# EAGLE design sensor2 (EAGLE 7.3.0)
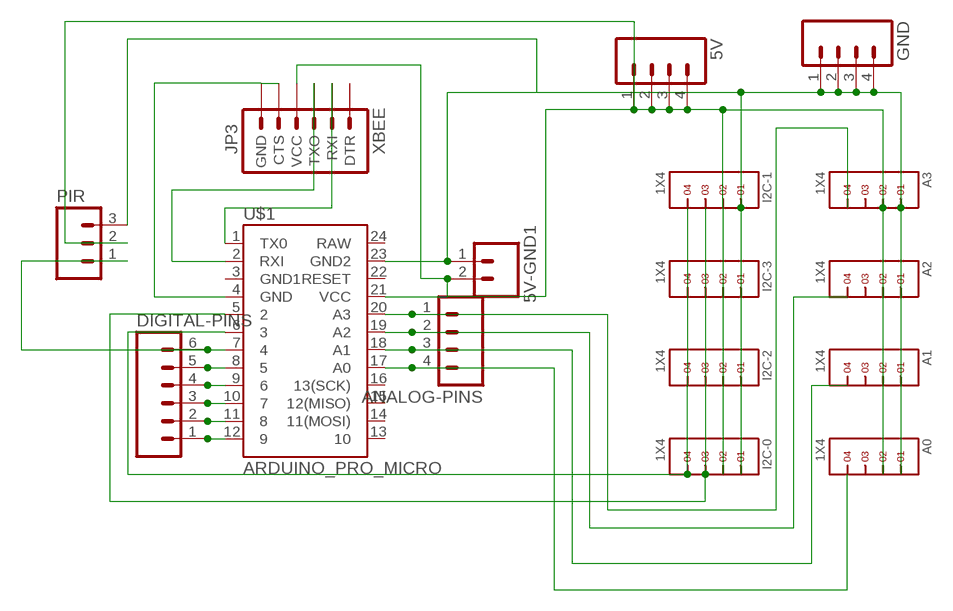
[diagram p0: schematic, sheet 1]

## Parts
5V  M04  [04P]
5V-GND1  M025MM  [SCREWTERMINAL-5MM-2]
A0  1X4  [1X4]
A1  1X4  [1X4]
A2  1X4  [1X4]
A3  1X4  [1X4]
ANALOG-PINS  M04  [04P]
DIGITAL-PINS  M06  [06P]
GND  M04  [04P]
I2C-0  1X4  [1X4]
I2C-1  1X4  [1X4]
I2C-2  1X4  [1X4]
I2C-3  1X4  [1X4]
JP3  XBEE  ARDUINO_SERIAL_PROGRAMPTH  [1X06]
PIR  M03  [03P]
U$1  ARDUINO_PRO_MICRO  [ARDUINO_PRO_MICRO]

## Nets
GND: 5V-GND1.1 A0.1 A1.1 A2.1 A3.1 GND.1 GND.2 GND.3 GND.4 I2C-0.1 I2C-1.1 I2C-2.1 I2C-3.1 PIR.3 U$1.23(GND2)
N$1: I2C-0.4 I2C-1.4 I2C-2.4 I2C-3.4 U$1.6
N$2: A3.4 ANALOG-PINS.1 U$1.20(A3)
N$3: JP3.5(CTS) JP3.6(GND) U$1.4(GND)
N$4: I2C-0.3 I2C-1.3 I2C-2.3 I2C-3.3 U$1.5
N$5: 5V-GND1.2 5V.1 5V.2 5V.3 5V.4 A0.2 A1.2 A2.2 A3.2 I2C-0.2 I2C-1.2 I2C-2.2 I2C-3.2 JP3.4(VCC) PIR.2 U$1.21(VCC)
N$6: A2.4 ANALOG-PINS.2 U$1.19(A2)
N$7: A1.4 ANALOG-PINS.3 U$1.18(A1)
N$8: JP3.2(RXI) U$1.1(TX0)
N$9: A0.4 ANALOG-PINS.4 U$1.17(A0)
N$10: JP3.3(TXO) U$1.2(RXI)
N$11: DIGITAL-PINS.2 U$1.11
N$13: DIGITAL-PINS.3 U$1.10
N$14: DIGITAL-PINS.4 U$1.9
N$15: DIGITAL-PINS.5 U$1.8
N$17: DIGITAL-PINS.6 PIR.1 U$1.7
N$18: DIGITAL-PINS.1 U$1.12
Unconnected: A0.3 A1.3 A2.3 A3.3 JP3.1(DTR) U$1.3(GND1) U$1.13 U$1.14(11(MOSI)) U$1.15(12(MISO)) U$1.16(13(SCK)) U$1.22(RESET) U$1.24(RAW)

## Library data of the parts
5V ANALOG-PINS GND = con-amp-quick:M04: AMP QUICK CONNECTOR; OC_FARNELL: unknown; OC_NEWARK: unknown
5V-GND1 = SparkFun-Connectors:M02: Header 2 Standard 2-pin 0.1" header. Use with straight break away headers (SKU : PRT-00116), right angle break away headers (PRT-00553), swiss pins (PRT-00743), machine pins (PRT-00117), and female headers (PRT-00115). Molex polarized connector foot print use with SKU : PRT-08233 with associated crimp pins and housings.
A0 A1-A3 I2C-0 I2C-1-I2C-3 = headers(2mm):1X4
DIGITAL-PINS = con-amp-quick:M06: AMP QUICK CONNECTOR; OC_FARNELL: unknown; OC_NEWARK: unknown
JP3 = SparkFun-Connectors:ARDUINO_SERIAL_PROGRAM: FTDI connector footprints
PIR = con-amp-quick:M03: AMP QUICK CONNECTOR; OC_FARNELL: unknown; OC_NEWARK: unknown
U$1 = SparkFun-Boards:ARDUINO_PRO_MICRO

## Board
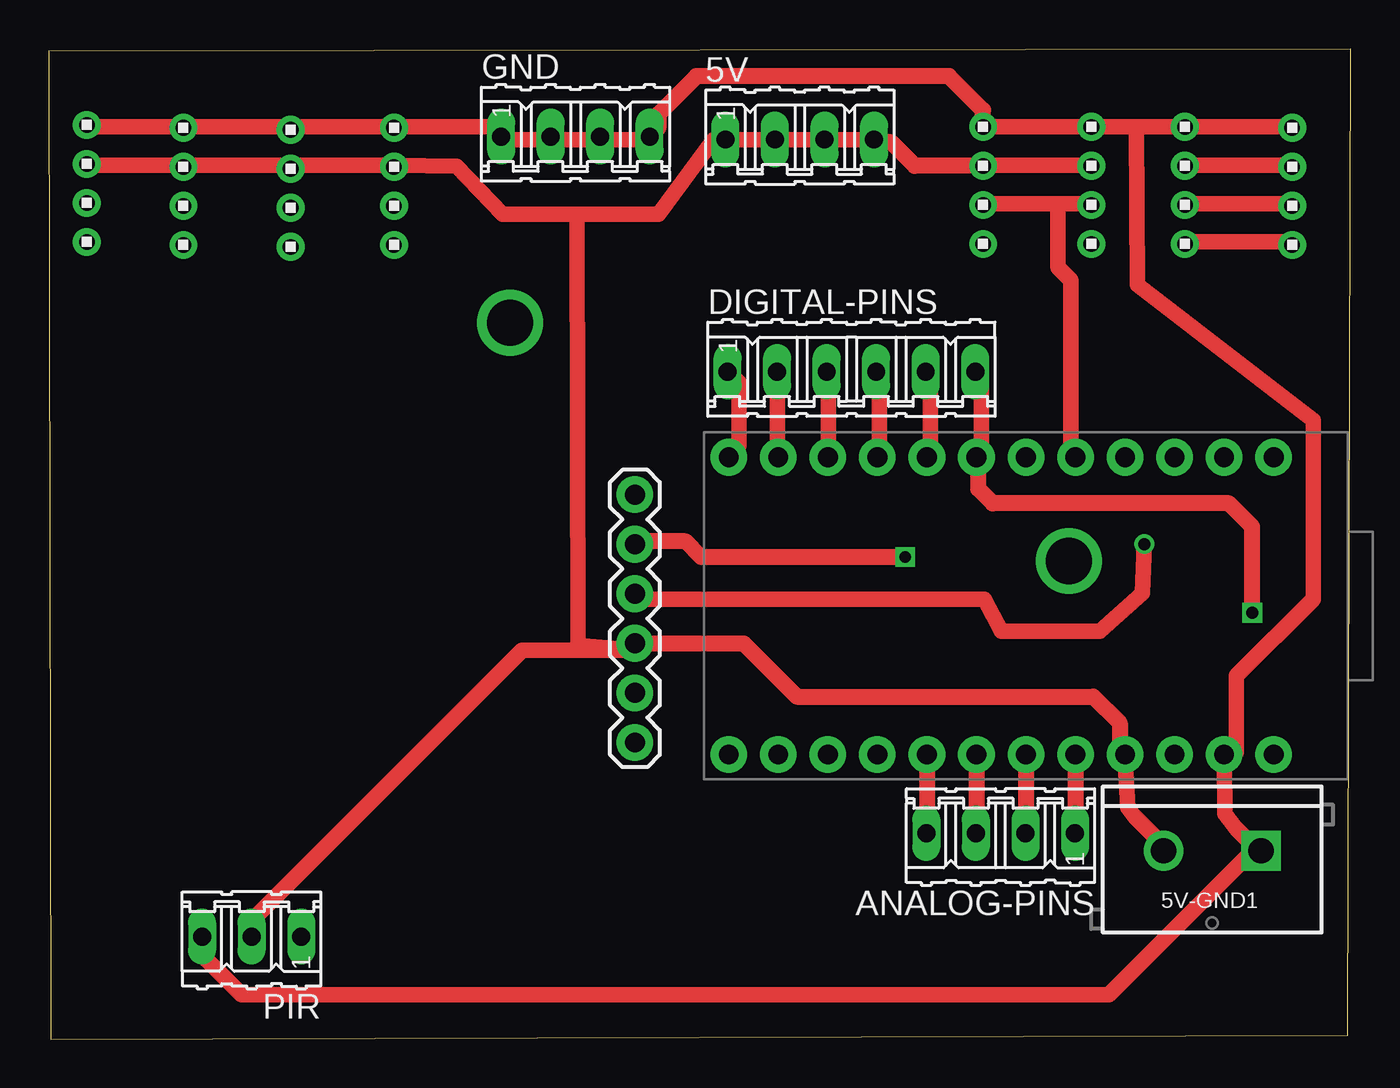
[diagram p1: board, top side]
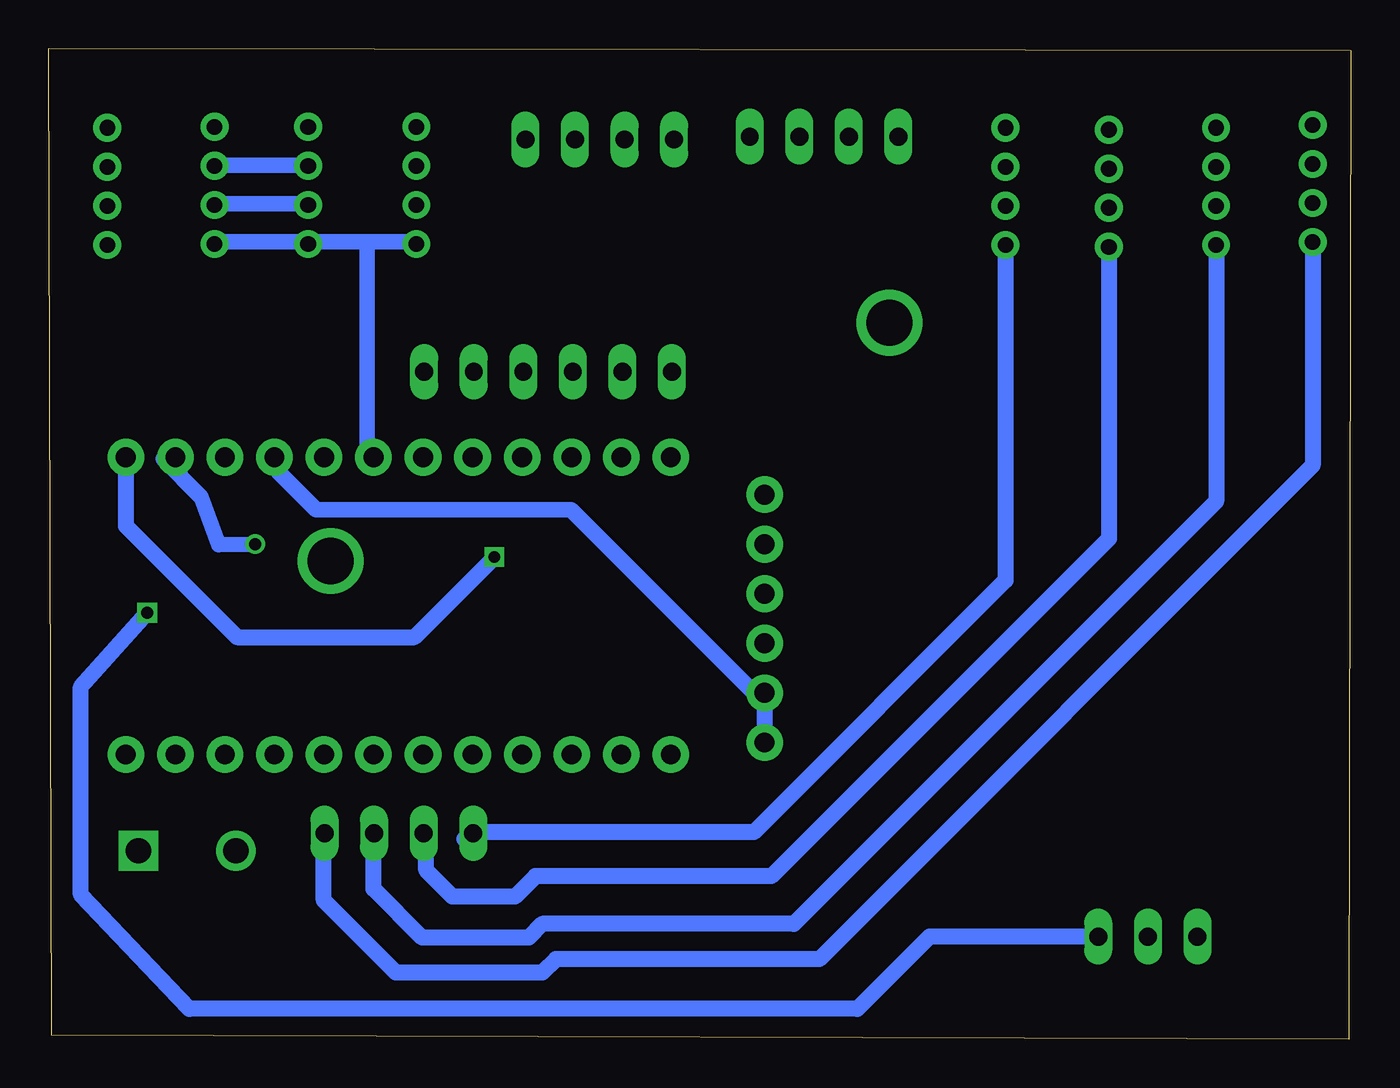
[diagram p2: board, bottom side, seen from below]

Size 66.75 x 50.75 mm. Coordinates in mm from the lower left corner, seen from the top.
Outline: 0.1,0 66.6,0.2 66.75,50.75 0,50.65 0.1,0
Copper layers (1*16): Top 0.035mm / dielectric 1.5mm / Bottom 0.035mm
Design rules "default": minimum track width 0.8mm, minimum drill 24mil, track to track 20mil, track to pad 20mil, pad to pad 20mil, via to via 20mil, smd to smd 8mil, copper to edge 40mil, drill to drill 10mil, minimum pad ring 10mil, minimum via ring 8mil, stop-mask expansion 4mil, vias tented up to drill 0mil, thermal gap 10mil

### Footprints (pad centres in the part's own frame; a part is rotated, then mirrored left to right if it is on the bottom)
04P = drill 0.914 long: 1 -3.81,0; 2 -1.27,0; 3 1.27,0; 4 3.81,0
SCREWTERMINAL-5MM-2 = drill 1.3 pad 2.032 square: 1 0,0 | drill 1.3 pad 2.032: 2 5,0
1X4 = drill 0.8 pad 1.422: 1 -3,0; 2 -1,0; 3 1,0; 4 3,0
06P = drill 0.914 long: 1 -6.35,0; 2 -3.81,0; 3 -1.27,0; 4 1.27,0; 5 3.81,0; 6 6.35,0
1X06 = drill 1.016 pad 1.88: 1 0,0; 2 2.54,0; 3 5.08,0; 4 7.62,0; 5 10.16,0; 6 12.7,0
03P = drill 0.914 long: 1 -2.54,0; 2 0,0; 3 2.54,0
ARDUINO_PRO_MICRO = drill 1.016 pad 1.88: 1 -7.62,12.7; 2 -7.62,10.16; 3 -7.62,7.62; 4 -7.62,5.08; 5 -7.62,2.54; 6 -7.62,0; 7 -7.62,-2.54; 8 -7.62,-5.08; 9 -7.62,-7.62; 10 -7.62,-10.16; 11 -7.62,-12.7; 12 -7.62,-15.24; 13 7.62,-15.24; 14 7.62,-12.7; 15 7.62,-10.16; 16 7.62,-7.62; 17 7.62,-5.08; 18 7.62,-2.54; 19 7.62,0; 20 7.62,2.54; 21 7.62,5.08; 22 7.62,7.62; 23 7.62,10.16; 24 7.62,12.7

### Placement (x,y rotation side)
5V  38.5,46.1 0 top
5V-GND1  62.15,9.65 180 top
A0  17.7,43.7 270 top
A1  12.4,43.6 270 top
A2  6.9,43.7 270 top
A3  1.95,43.85 270 top
ANALOG-PINS  48.8,10.55 180 top
DIGITAL-PINS  41.15,34.2 0 top
GND  27,46.25 0 top
I2C-0  47.9,43.75 270 top
I2C-1  53.45,43.75 270 top
I2C-2  58.25,43.75 270 top
I2C-3  63.75,43.7 270 top
JP3  30.05,27.9 270 top
PIR  10.4,5.25 180 top
U$1  50.1,22.2 270 top

### Tracks (layer width: path | path; a pad name or v marks a point on that pad's centre or on a via)
GND
  Top 0.8: PIR.3 7.92,4.89 7.92,4.23 9.88,2.27 54.35,2.27 61.55,9.47 5V-GND1.1 61.55,10.12 60.89,10.77 60.29,11.54 U$1.23 60.89,14.7 60.89,18.62 64.82,22.55 64.82,31.7 55.82,38.65 55.77,46.74 | I2C-0.1 48.47,46.74 53.05,46.74 I2C-1.1 53.7,46.74 55.77,46.74 | 55.77,46.74 57.62,46.74 I2C-2.1 58.28,46.74 63.51,46.74 I2C-3.1 | GND.4 30.81,46.09 28.85,46.09 GND.3 28.19,46.09 26.23,46.09 GND.2 25.58,46.09 23.62,46.09 GND.1 22.96,46.74 17.73,46.74 A0.1 17.08,46.74 12.5,46.74 A1.1 11.84,46.74 7.27,46.74 A2.1 6.61,46.74 2.03,46.74 A3.1
  Top 0.813: I2C-0.1 47.9,47.6 46.15,49.35 33.2,49.35 31.25,47.4 31.25,46.69 GND.4
N$1
  Top 0.8: I2C-3.4 63.51,40.86 58.28,40.86 I2C-2.4
  Bottom 0.8: 50.43,40.86 53.05,40.86 I2C-1.4 53.7,40.86 57.62,40.86 I2C-2.4 | 50.43,40.86 48.47,40.86 I2C-0.4 | 50.43,40.86 50.43,30.39 U$1.6
N$2
  Top 0.813: U$1.20 52.64,10.58 ANALOG-PINS.1
  Bottom 0.813: A3.4 1.95,29.4 27.25,4.1 40.75,4.1 41.45,3.4 48.95,3.4 52.65,7.1 52.65,10.51 ANALOG-PINS.1
N$3
  Bottom 0.8: U$1.4 55.01,29.74 55.01,29.09 53.05,27.12 39.97,27.12 30.16,17.31 JP3.5
  Bottom 0.813: JP3.5 JP3.6
N$4
  Top 0.8: 51.74,42.82 53.05,42.82 I2C-1.3 | 51.74,42.82 48.47,42.82 I2C-0.3 | I2C-3.3 63.51,42.82 58.28,42.82 I2C-2.3 | 51.74,42.82 51.74,39.55 52.39,38.9 52.39,30.39 U$1.5
  Bottom 0.8: I2C-2.3 57.62,42.82 53.7,42.82 I2C-1.3
N$5
  Top 0.8: U$1.21 55.31,11.84 55.66,11.43 56.97,10.12 5V-GND1.2 | PIR.2 10.54,5.54 10.54,6.2 24.27,19.93 29.5,19.93 JP3.4 29.55,19.98 27.14,20.19 27.09,42.27 | A3.2 2.03,44.78 6.61,44.78 A2.2 7.27,44.78 11.84,44.78 A1.2 12.5,44.78 17.08,44.78 A0.2 17.73,44.78 20.9,44.73 23.26,42.27 27.09,42.27 | 5V.4 41.93,46.09 39.97,46.09 5V.3 39.31,46.09 37.35,46.09 5V.2 36.7,46.09 34.73,46.09 5V.1 34.08,46.09 31.26,42.27 27.09,42.27 | I2C-0.2 48.47,44.78 53.05,44.78 I2C-1.2 | I2C-3.2 63.51,44.78 58.28,44.78 I2C-2.2
  Top 0.813: JP3.4 35.62,20.28 38.35,17.55 53.55,17.55 54.9,16.2 54.9,14.86 U$1.21 | I2C-0.2 44.4,44.75 43.2,45.95 42.46,45.95 5V.4
  Bottom 0.8: I2C-2.2 57.62,44.78 53.7,44.78 I2C-1.2
N$6
  Top 0.813: U$1.19 50.1,10.58 ANALOG-PINS.2
  Bottom 0.813: A2.4 6.9,27.55 28.55,5.9 41.45,5.9 42.15,5.2 47.6,5.2 50.1,7.7 50.1,10.52 ANALOG-PINS.2
N$7
  Top 0.813: U$1.18 47.56,10.58 ANALOG-PINS.3
  Bottom 0.813: A1.4 12.4,25.65 29.7,8.35 41.8,8.35 42.85,7.3 46.05,7.3 47.4,8.65 47.4,10.42 ANALOG-PINS.3
N$8  (via drill 0.6)
  Top 0.813: v43.9,24.7 33.45,24.7 32.65,25.5 30.19,25.5 JP3.2
  Bottom 0.813: U$1.1 62.8,26.3 57.1,20.6 48,20.6 v43.9,24.7
N$9
  Top 0.813: U$1.17 45.02,10.58 ANALOG-PINS.4
  Bottom 0.813: A0.4 17.7,23.5 30.6,10.6 45.1,10.6 45.45,10.25 45.29,10.25 ANALOG-PINS.4
N$10  (via drill 0.61)
  Top 0.8: v56.17,25.37 56.07,22.86 53.9,20.89 48.83,20.89 47.98,22.55 30.16,22.55 JP3.3
  Bottom 0.8: v56.17,25.37 58.03,25.33 58.93,27.78 60.89,29.74 U$1.2
N$11
  Top 0.8: 37.35,34.32 DIGITAL-PINS.2 37.35,33.66 37.35,30.39 U$1.11
N$12  (via drill 2.36)
  other vias: 23.65,36.7
N$13
  Top 0.8: 39.97,34.32 DIGITAL-PINS.3 39.97,33.66 39.97,30.39 U$1.10
N$14
  Top 0.8: 42.58,34.32 DIGITAL-PINS.4 42.58,33.66 42.58,30.39 U$1.9
N$15
  Top 0.8: 45.2,34.32 DIGITAL-PINS.5 45.2,33.66 45.2,30.39 U$1.8
N$16  (via drill 2.36)
  other vias: 52.3,24.5
N$17  (via drill 0.6)
  Top 0.8: 47.81,34.32 DIGITAL-PINS.6 47.81,33.66 47.81,30.39 U$1.7
  Top 0.813: v61.7,21.85 61.7,26.25 60.5,27.45 48.4,27.45 47.65,28.2 47.65,29.73 U$1.7
  Bottom 0.813: PIR.1 21.6,5.25 25.3,1.55 59.55,1.55 65.1,7.4 65.1,18.05 v61.7,21.85
N$18
  Top 0.8: DIGITAL-PINS.1 35.39,33.66 35.39,30.39 U$1.12